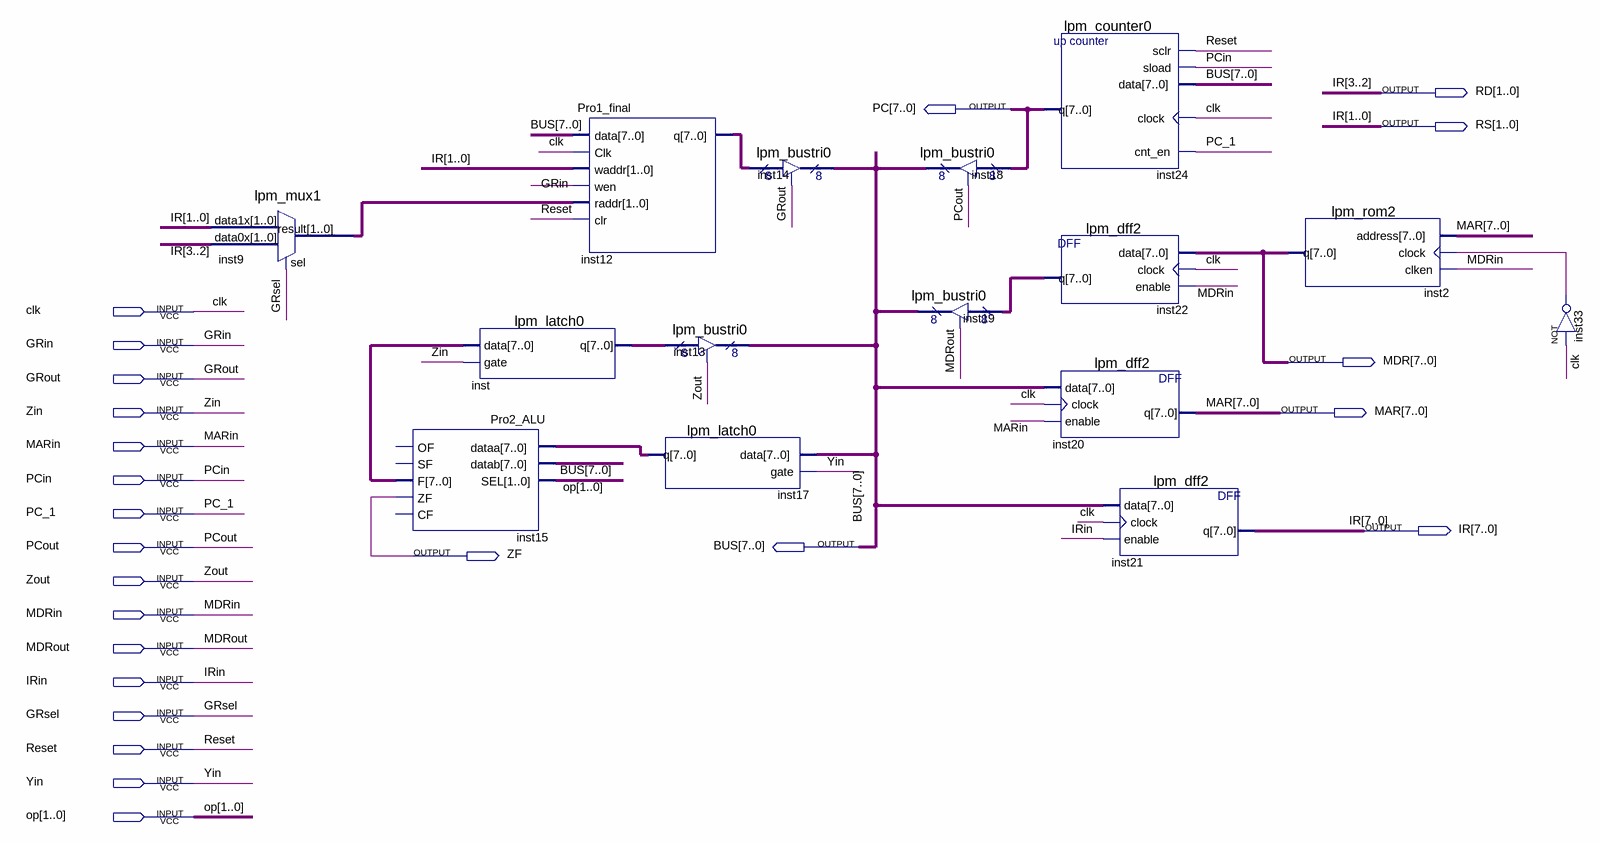
[diagram p0: schematic sheet]
// Quartus schematic Pro4_new.bdf as structural Verilog: 15 symbols, 24 pins
module Pro4_new (
  input  clk,
  input  GRin,
  input  GRout,
  input  Zin,
  input  MARin,
  input  PCin,
  input  PC_1,
  input  PCout,
  input  Zout,
  input  MDRin,
  input  MDRout,
  input  IRin,
  input  GRsel,
  input  Reset,
  input  Yin,
  input  [1:0] op,
  output [1:0] RD,
  output [7:0] PC,
  output [1:0] RS,
  output [7:0] MDR,
  output [7:0] MAR,
  output [7:0] IR,
  output [7:0] BUS,
  output ZF
);

  wire inst33_out;
  wire [1:0] inst9_result;
  wire [7:0] inst12_q, inst15_f, inst17_q, inst22_q, inst_q;

  lpm_mux1 inst9 (.data1x(IR[1:0]), .data0x(IR[3:2]), .sel(GRsel), .result(inst9_result));
  Pro2_ALU inst15 (.dataa(inst17_q), .datab(BUS), .SEL(op), .F(inst15_f), .ZF(ZF));  // open: OF, SF, CF
  lpm_latch0 inst (.data(inst15_f), .gate(Zin), .q(inst_q));
  Pro1_final inst12 (
    .data(BUS), .Clk(clk), .waddr(IR[1:0]), .wen(GRin), .raddr(inst9_result), .clr(Reset), .q(inst12_q));
  lpm_bustri0 inst13 (.enabledt(Zout), .data(inst_q), .tridata(BUS));
  lpm_latch0 inst17 (.data(BUS), .gate(Yin), .q(inst17_q));
  lpm_bustri0 inst14 (.enabledt(GRout), .data(inst12_q), .tridata(BUS));
  lpm_bustri0 inst18 (.enabledt(PCout), .data(PC), .tridata(BUS));
  lpm_bustri0 inst19 (.enabledt(MDRout), .data(inst22_q), .tridata(BUS));
  lpm_counter0 inst24 (.sclr(Reset), .sload(PCin), .data(BUS), .clock(clk), .cnt_en(PC_1), .q(PC));
  lpm_dff2 inst22 (.data(MDR), .clock(clk), .enable(MDRin), .q(inst22_q));
  lpm_dff2 inst20 (.data(BUS), .clock(clk), .enable(MARin), .q(MAR));
  lpm_dff2 inst21 (.data(BUS), .clock(clk), .enable(IRin), .q(IR));
  lpm_rom2 inst2 (.address(MAR), .clock(inst33_out), .clken(MDRin), .q(MDR));
  not inst33 (inst33_out, clk);

  assign RD = IR[3:2];
  assign RS = IR[1:0];
endmodule
